# EAGLE design Meanwell_FE (EAGLE 9.7.0)

## Sheet 1 of 2
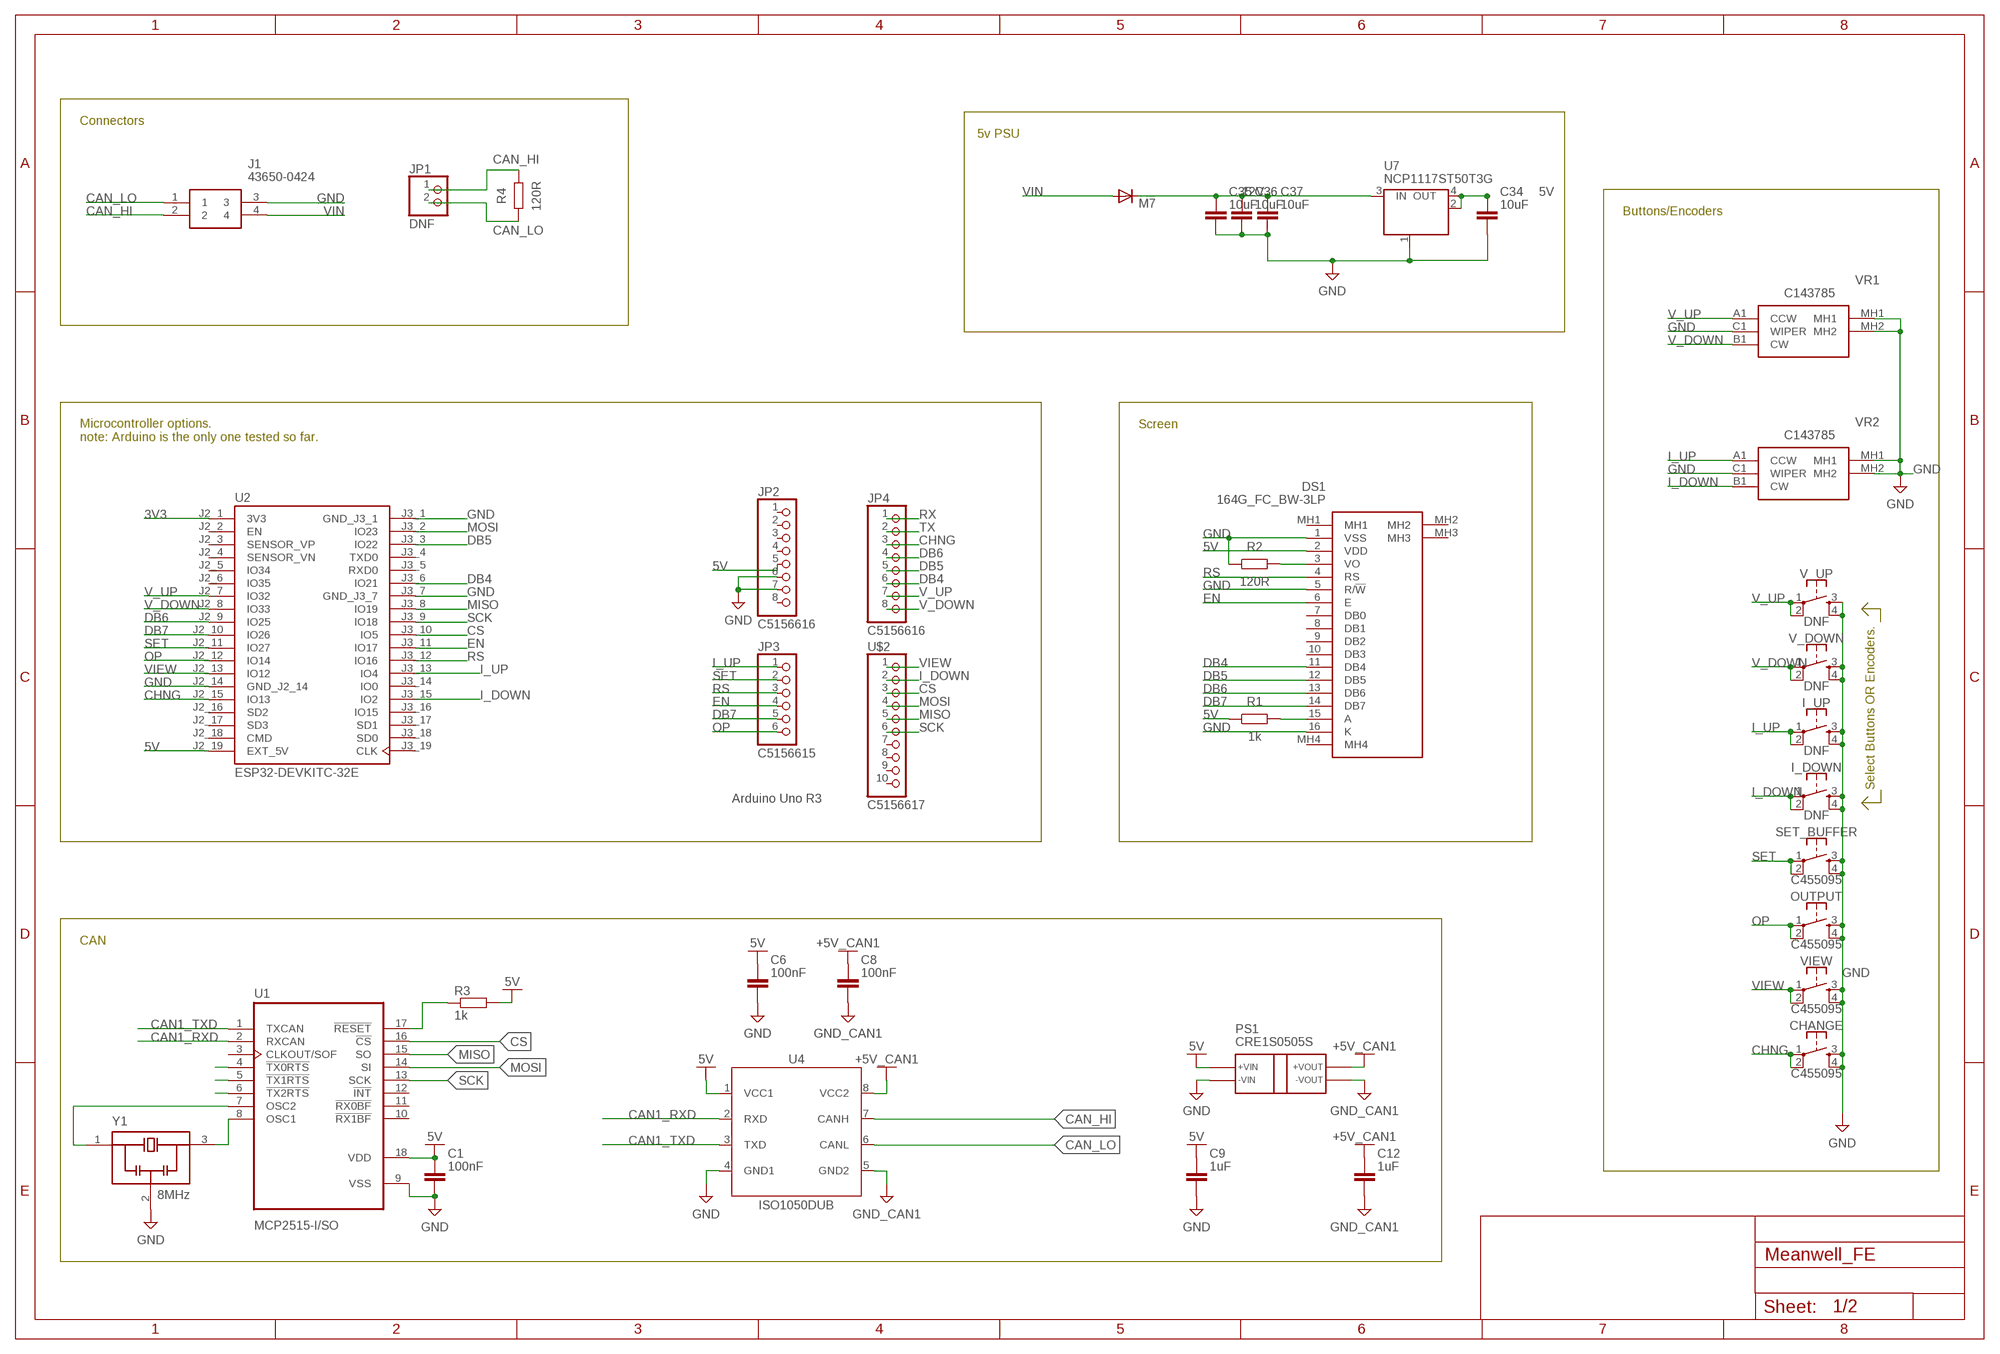
[diagram p0: schematic, sheet 1]

### Parts
C1  100nF  C_CHIP-0603(1608-METRIC)  [CAPC1608X85]
C6  100nF  C_CHIP-0603(1608-METRIC)  [CAPC1608X85]
C8  100nF  C_CHIP-0603(1608-METRIC)  [CAPC1608X85]
C9  1uF  C_CHIP-0603(1608-METRIC)  [CAPC1608X85]
C12  1uF  C_CHIP-0603(1608-METRIC)  [CAPC1608X85]
C34  10uF  C_CHIP-0805(2012-METRIC)  [CAPC2012X110]
C35  10uF  C_CHIP-0805(2012-METRIC)  [CAPC2012X110]
C36  10uF  C_CHIP-0805(2012-METRIC)  [CAPC2012X110]
C37  10uF  C_CHIP-0805(2012-METRIC)  [CAPC2012X110]
CHANGE  C455095  SWITCH_MOMENTARY  [SWITCH-MOMENTARY-PTH-6.5MM]
D1  M7  DIODE-SMB  [SMB]
DS1  164G_FC_BW-3LP  [164GFCBW3LP]
I_DOWN  DNF  SWITCH_MOMENTARY  [SWITCH-MOMENTARY-PTH-6.5MM]
I_UP  DNF  SWITCH_MOMENTARY  [SWITCH-MOMENTARY-PTH-6.5MM]
J1  43650-0424  [43650-04YY_242526]
JP1  DNF  PINHD-1X2  [1X02]
JP2  C5156616  PINHD-1X8BIG  [1X08-BIG]
JP3  C5156615  PINHD-1X6B  [1X06-BIG]
JP4  C5156616  PINHD-1X8BIG  [1X08-BIG]
OUTPUT  C455095  SWITCH_MOMENTARY  [SWITCH-MOMENTARY-PTH-6.5MM]
PS1  CRE1S0505S  [CRE1(SC)]
R1  1k  R_CHIP-0603(1608-METRIC)  [RESC1608X60]
R2  120R  R_CHIP-0603(1608-METRIC)  [RESC1608X60]
R3  1k  R_CHIP-0603(1608-METRIC)  [RESC1608X60]
R4  120R  R_CHIP-0603(1608-METRIC)  [RESC1608X60]
SET_BUFFER  C455095  SWITCH_MOMENTARY  [SWITCH-MOMENTARY-PTH-6.5MM]
U1  MCP2515-I/SO  [SOIC127P1030X265-18N]
U2  ESP32-DEVKITC-32E  [MODULE_ESP32-DEVKITC-32E]
U4  ISO1050DUB  [SOP254P1040X485-8]
U7  NCP1117ST50T3G  MC33269ST-3.3T3  [SOT223]
U$2  C5156617  PINHD-1X10  [1X10-BIG]
V_DOWN  DNF  SWITCH_MOMENTARY  [SWITCH-MOMENTARY-PTH-6.5MM]
V_UP  DNF  SWITCH_MOMENTARY  [SWITCH-MOMENTARY-PTH-6.5MM]
VIEW  C455095  SWITCH_MOMENTARY  [SWITCH-MOMENTARY-PTH-6.5MM]
VR1  C143785  PEC12R-4215F-N0024  [PEC12R4215FN0024]
VR2  C143785  PEC12R-4215F-N0024  [PEC12R4215FN0024]
Y1  8MHz  CSTNE8M00GH5C000R0  [OSC_CSTNE8M00GH5C000R0]

### Nets
3V3: U2.J2_1(3V3)
5V: C1.1 C6.1 C9.1 C34.1 DS1.2(VDD) JP2.5 PS1.2(+VIN) R1.1 R3.2 U1.18(VDD) U2.J2_19(EXT_5V) U4.1(VCC1) U7.2(OUT) U7.4(OUT)
12V: C35.1 C36.1 C37.1 D1.C U7.3(IN)
+5V_CAN1: C8.1 C12.1 PS1.4(+VOUT) U4.8(VCC2)
CAN1_RXD: U1.2(RXCAN) U4.2(RXD)
CAN1_TXD: U1.1(TXCAN) U4.3(TXD)
CAN_HI: J1.2 JP1.1 R4.2 U4.7(CANH)
CAN_LO: J1.1 JP1.2 R4.1 U4.6(CANL)
CHNG: CHANGE.1 CHANGE.2 JP4.3 U2.J2_15(IO13)
CS: U1.16(!CS) U2.J3_10(IO5) U$2.3
DB4: DS1.11(DB4) JP4.6 U2.J3_6(IO21)
DB5: DS1.12(DB5) JP4.5 U2.J3_3(IO22)
DB6: DS1.13(DB6) JP4.4 U2.J2_9(IO25)
DB7: DS1.14(DB7) JP3.5 U2.J2_10(IO26)
EN: DS1.6(E) JP3.4 U2.J3_11(IO17)
GND: C1.2 C6.2 C9.2 C34.2 C35.2 C36.2 C37.2 CHANGE.3 CHANGE.4 DS1.1(VSS) DS1.5(R/!W) DS1.16(K) I_DOWN.3 I_DOWN.4 I_UP.3 I_UP.4 J1.3 JP2.6 JP2.7 OUTPUT.3 OUTPUT.4 PS1.1(-VIN) R2.1 SET_BUFFER.3 SET_BUFFER.4 U1.9(VSS) U2.J2_14(GND_J2_14) U2.J3_1(GND_J3_1) U2.J3_7(GND_J3_7) U4.4(GND1) U7.1(GND/ADJ) V_DOWN.3 V_DOWN.4 V_UP.3 V_UP.4 VIEW.3 VIEW.4 VR1.C1(WIPER) VR1.MH1 VR1.MH2 VR2.C1(WIPER) VR2.MH1 VR2.MH2 Y1.2(GND)
GND_CAN1: C8.2 C12.2 PS1.3(-VOUT) U4.5(GND2)
I_DOWN: I_DOWN.1 I_DOWN.2 U2.J3_15(IO2) U$2.2 VR2.B1(CW)
I_UP: I_UP.1 I_UP.2 JP3.1 U2.J3_13(IO4) VR2.A1(CCW)
MISO: U1.15(SO) U2.J3_8(IO19) U$2.5
MOSI: U1.14(SI) U2.J3_2(IO23) U$2.4
N$1: DS1.3(VO) R2.2
N$6: U1.7(OSC2) Y1.1(IN)
N$8: DS1.15(A) R1.2
N$12: R3.1 U1.17(!RESET)
N$13: U1.8(OSC1) Y1.3(OUT)
N$170: U1.4(!TX0RTS)
N$171: U1.5(!TX1RTS)
N$172: U1.6(!TX2RTS)
OP: JP3.6 OUTPUT.1 OUTPUT.2 U2.J2_12(IO14)
RS: DS1.4(RS) JP3.3 U2.J3_12(IO16)
RX: JP4.1
SCK: U1.13(SCK) U2.J3_9(IO18) U$2.6
SET: JP3.2 SET_BUFFER.1 SET_BUFFER.2 U2.J2_11(IO27)
TX: JP4.2
V_DOWN: JP4.8 U2.J2_8(IO33) V_DOWN.1 V_DOWN.2 VR1.B1(CW)
V_UP: JP4.7 U2.J2_7(IO32) V_UP.1 V_UP.2 VR1.A1(CCW)
VIEW: U2.J2_13(IO12) U$2.1 VIEW.1 VIEW.2
VIN: D1.A J1.4
Unconnected: DS1.7(DB0) DS1.8(DB1) DS1.9(DB2) DS1.10(DB3) DS1.MH1 DS1.MH2 DS1.MH3 DS1.MH4 JP2.1 JP2.2 JP2.3 JP2.4 JP2.8 U1.3(CLKOUT/SOF) U1.10(!RX1BF) U1.11(!RX0BF) U1.12(!INT) U2.J2_2(EN) U2.J2_3(SENSOR_VP) U2.J2_4(SENSOR_VN) U2.J2_5(IO34) U2.J2_6(IO35) U2.J2_16(SD2) U2.J2_17(SD3) U2.J2_18(CMD) U2.J3_4(TXD0) U2.J3_5(RXD0) U2.J3_14(IO0) U2.J3_16(IO15) U2.J3_17(SD1) U2.J3_18(SD0) U2.J3_19(CLK) U$2.7 U$2.8 U$2.9 U$2.10

### Notes on the sheet
- Connectors
- 5v PSU
- Buttons/Encoders
- Screen
- Microcontroller options.
  note: Arduino is the only one tested so far.
- Select Buttons OR Encoders.
- Arduino Uno R3
- CAN

## Sheet 2 of 2
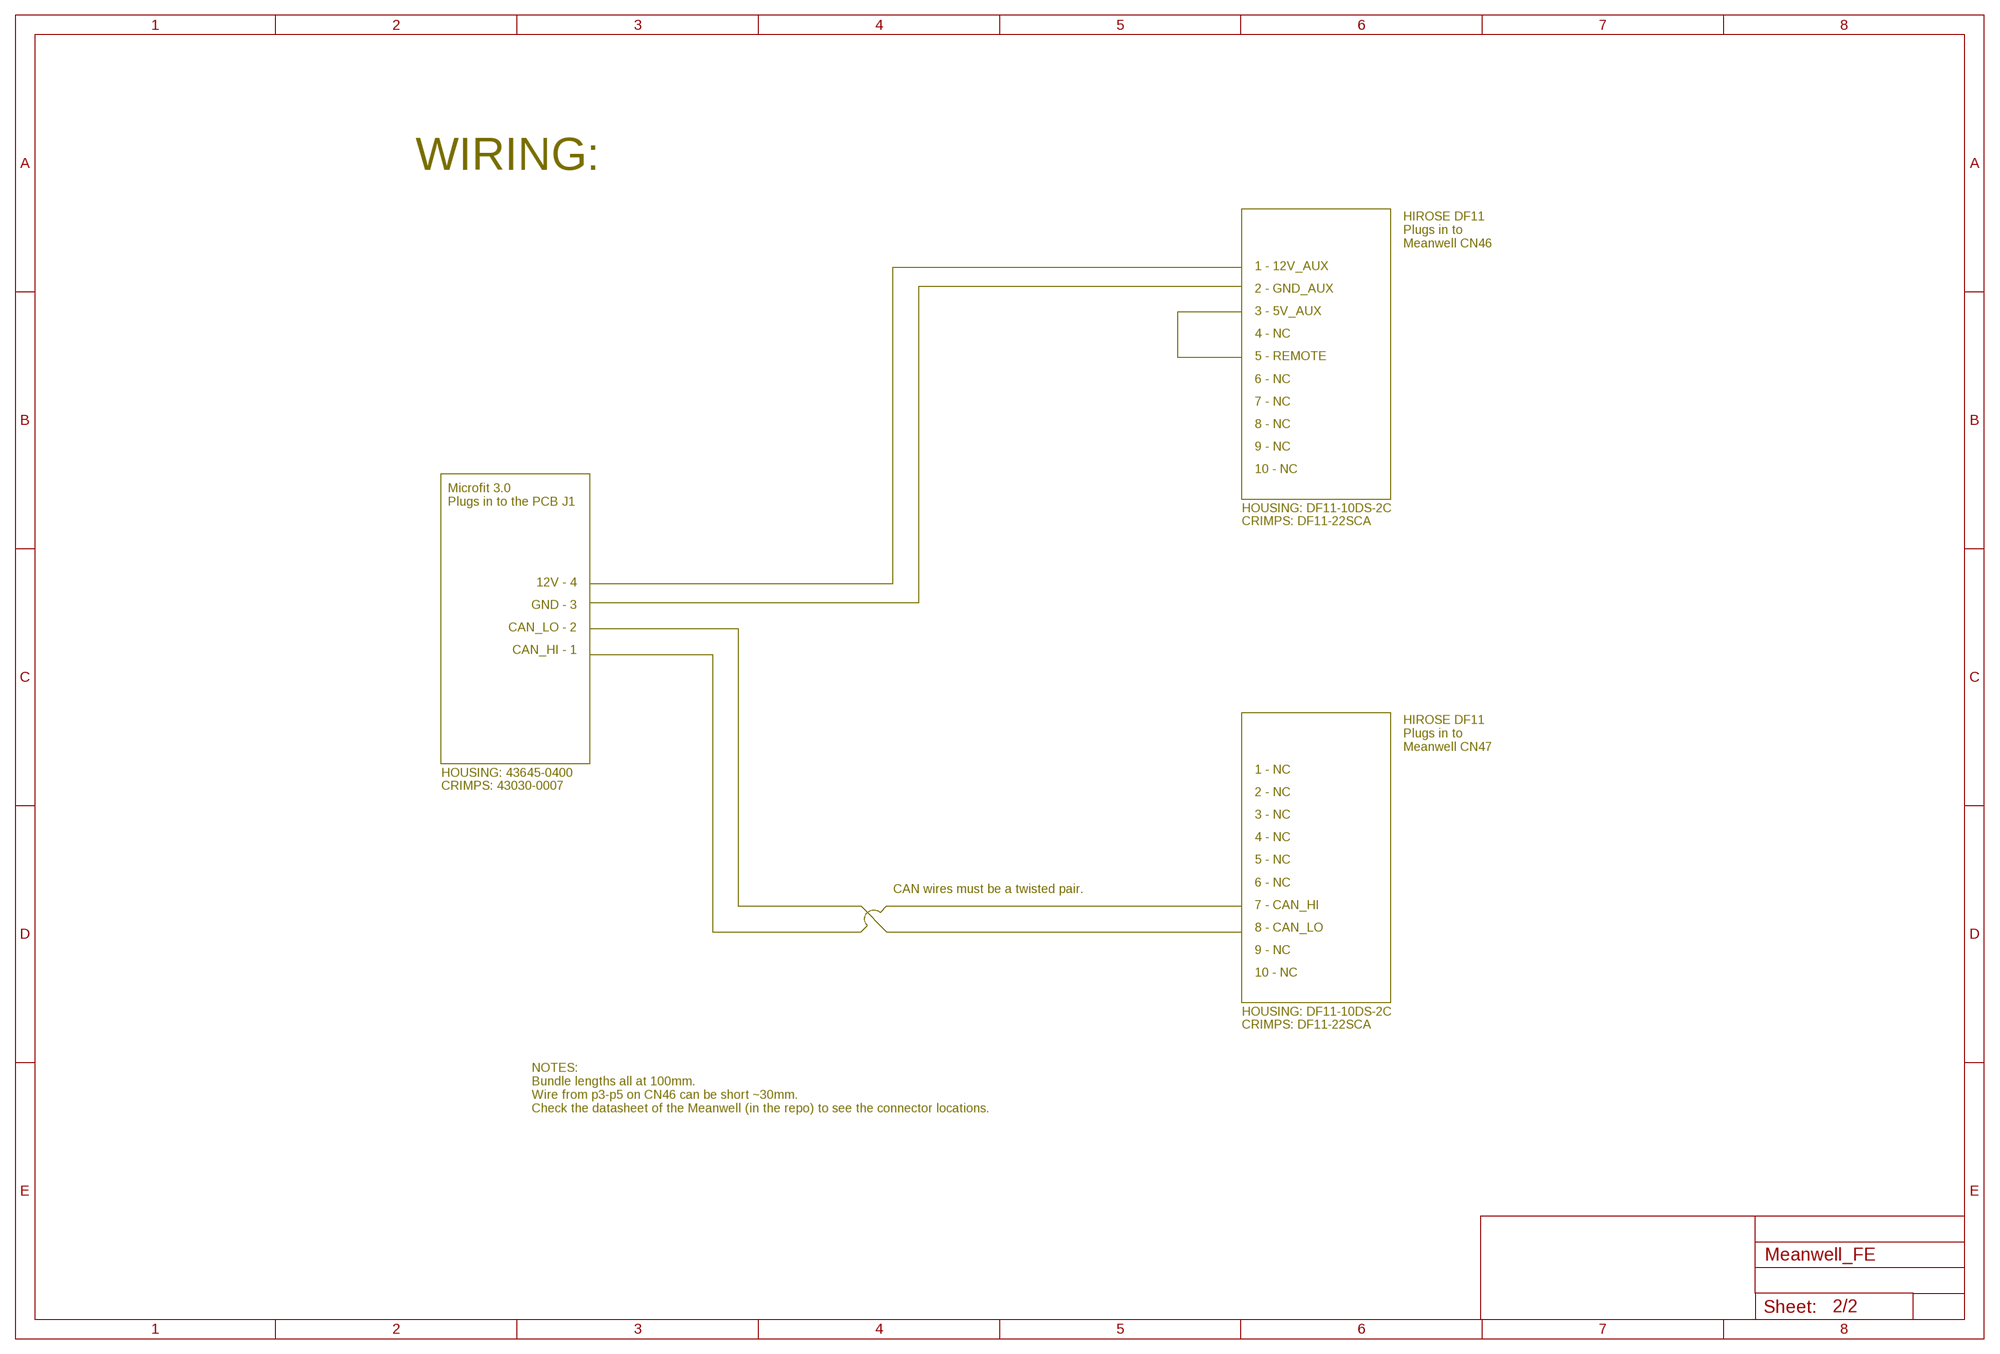
[diagram p1: schematic, sheet 2]

### Notes on the sheet
- WIRING:
- HIROSE DF11
  Plugs in to 
  Meanwell CN46
- 1 - 12V_AUX
  2 - GND_AUX
  3 - 5V_AUX
  4 - NC
  5 - REMOTE
  6 - NC
  7 - NC
  8 - NC
  9 - NC
  10 - NC
- Microfit 3.0
  Plugs in to the PCB J1
- HOUSING: DF11-10DS-2C
- CRIMPS: DF11-22SCA
- 12V - 4
  GND - 3
  CAN_LO - 2
  CAN_HI - 1
- HIROSE DF11
  Plugs in to 
  Meanwell CN47
- HOUSING: 43645-0400
- CRIMPS: 43030-0007
- CAN wires must be a twisted pair.
- 1 - NC
  2 - NC
  3 - NC
  4 - NC
  5 - NC
  6 - NC
  7 - CAN_HI
  8 - CAN_LO
  9 - NC
  10 - NC
- HOUSING: DF11-10DS-2C
- CRIMPS: DF11-22SCA
- NOTES:
  Bundle lengths all at 100mm.
  Wire from p3-p5 on CN46 can be short ~30mm.
  Check the datasheet of the Meanwell (in the repo) to see the connector locations.

## Library data of the parts
C1 C6 C8 C9 C12 = Capacitor:C: Capacitor - Generic; CATEGORY: Capacitor; PACKAGE_SIZE: 0603; PACKAGE_TYPE: SMD; SUBCATEGORY: Ceramic Capacitors; TYPE: MLCC
C34-C37 = Capacitor:C: Capacitor - Generic; CATEGORY: Capacitor; PACKAGE_SIZE: 0805; PACKAGE_TYPE: SMD; SUBCATEGORY: Ceramic Capacitors; TYPE: MLCC
CHANGE I_DOWN I_UP OUTPUT SET_BUFFER V_DOWN V_UP VIEW = Tinkercad:SWITCH_MOMENTARY
D1 = Diode:DIODE-: DIODE
DS1 = Jack'sLib:164G_FC_BW-3LP: LCD Character Display Modules & Accessories 16x4 Char Display FSTN White 6 oclock Source: Datasheet <https://datasheet.datasheetarchive.com/originals/distributors/Datasheets_SAMA/5906eb3b59377bdb5eee9d672233fb3c.pdf>; DESCRIPTION: LCD Character Display Modules & Accessories 16x4 Char Display FSTN White 6 oclock; HEIGHT: 10.6mm; MANUFACTURER_NAME: Displaytech; MANUFACTURER_PART_NUMBER: 164G FC BW-3LP; MOUSER_PART_NUMBER: N/A; MOUSER_PRICE-STOCK: https://www.mouser.co.uk/ProductDetail/Displaytech/164G-FC-BW-3LP?qs=BJlw7L4Cy78q8isRIsBUGg%3D%3D
J1 = Jack'sLib:43650-0424: Micro-Fit 3.0 Vertical Header, 3.00mm Pitch, Single Row, 4 Circuits, with Solder Tab Source: Datasheet <https://www.molex.com/pdm_docs/sd/436500224_sd.pdf>; DESCRIPTION: Micro-Fit 3.0 Vertical Header, 3.00mm Pitch, Single Row, 4 Circuits, with Solder Tab; HEIGHT: 9.9mm; MANUFACTURER_NAME: Molex; MANUFACTURER_PART_NUMBER: 43650-0424; MOUSER_PART_NUMBER: 538-43650-0424; MOUSER_PRICE-STOCK: https://www.mouser.co.uk/ProductDetail/Molex/43650-0424?qs=9hH17QIRXQ1aOH%2Fg6k69OQ%3D%3D
JP1 = Connector:PINHD-1X2: PIN HEADER; CATEGORY: Headers; DESCRIPTION: Header-Straight-2 Position; PACKAGE_TYPE: THT; PITCH: 0.100" (2.54mm); SUBCATEGORY: Headers-Male Pins; TYPE: Board to Board or Cable-Unshrouded-Through Hole-Straight
JP2 JP4 = adafruit:PINHD-1X8: PIN HEADER
JP3 = adafruit:PINHD-1X6: PIN HEADER
PS1 = ISO_DCDCs:CRE1S0505S: Isolated 1W Single Output Isolated DC/DC Converters Source: Datasheet <http://power.murata.com/datasheet?/data/power/ncl/kdc_cre1.pdf>; DESCRIPTION: Isolated 1W Single Output Isolated DC/DC Converters; HEIGHT: mm; MANUFACTURER_NAME: Murata Electronics; MANUFACTURER_PART_NUMBER: CRE1S2405SC; MOUSER_PART_NUMBER: 580-CRE1S2405SC; MOUSER_PRICE-STOCK: https://www.mouser.co.uk/ProductDetail/Murata-Power-Solutions/CRE1S2405SC?qs=pFP7BvE1PmwUsyXD%252BXcXxQ%3D%3D
R1-R4 = Resistor:R: Resistor Fixed - Generic; CATEGORY: Resistors; DESCRIPTION: Chip Resistor 1.60 X 0.82 X 0.60 mm body 0603(1608-METRIC) Package; PACKAGE_SIZE: 0603; PACKAGE_TYPE: SMD
U1 = MCP2515:MCP2515-I/SO: Check availability <https://pricing.snapeda.com/parts/MCP2515-I/SO/Microchip/view-part?ref=eda>; AVAILABILITY: In Stock; CHECK_PRICES: https://www.snapeda.com/parts/MCP2515-I/SO/Microchip/view-part/?ref=eda; DESCRIPTION: Microchip CAN Controller 1Mbit/s CAN 2.0B 18-Pin SOIC W | Microchip Technology Inc. MCP2515-I/SO; MF: Microchip; MP: MCP2515-I/SO; PACKAGE: SOIC-18 Microchip; PRICE: None; SNAPEDA_LINK: https://www.snapeda.com/parts/MCP2515-I/SO/Microchip/view-part/?ref=snap
U2 = Jack'sLib:ESP32-DEVKITC-32E; MANUFACTURER: Espressif Systems; PARTREV: 1.4; STANDARD: Manufacturer Recommendations
U4 = IC_Interface:ISO1050DUB*: Isolated CAN Transceiver SOP-8 Datasheet <https://www.ti.com/lit/ds/symlink/iso1050.pdf?HQS=dis-dk-null-digikeymode-dsf-pf-null-wwe&ts=1611898260031>; CATEGORY: Interface IC; DATASHEET: https://www.ti.com/lit/ds/symlink/iso1050.pdf; DESCRIPTION: 1/1 Transceiver - Isolated Half CANbus 8-SOP; MANUFACTURER: Texas Instruments; MPN: ISO1050DUB; OPERATING_TEMPERATURE: -55°C ~ 105°C; PACKAGE_SIZE: 8-SOP; PACKAGE_TYPE: SMD; PART_STATUS: OBSOLETE; ROHS: COMPLIANT; SERIES: ISO1050; SUBCATEGORY: CANbus Transceiver; TYPE: Isolated Transceiver
U7 = linear:MC33269ST*: Adjustable Output Low Dropout Voltage Regulator 800 mA Source: http://www.onsemi.com/pub/Collateral/MC33269-D.PDF
U$2 = adafruit:PINHD-1X10: Pin header 1x10 0.1" spacing With round pins
VR1 VR2 = Jack'sLib:PEC12R-4215F-N0024: Encoders ENCODER Source: Datasheet <https://www.arrow.com/en/products/pec12r-4215f-n0024/bourns>; DESCRIPTION: Encoders ENCODER; HEIGHT: 15mm; MANUFACTURER_NAME: Bourns; MANUFACTURER_PART_NUMBER: PEC12R-4215F-N0024; MOUSER_PART_NUMBER: 652-PEC12R4215FN0024; MOUSER_PRICE-STOCK: https://www.mouser.co.uk/ProductDetail/Bourns/PEC12R-4215F-N0024?qs=pxDZlBjcsChk7Z90MBi1FA%3D%3D
Y1 = CSTNE8M00GH5C000R0:CSTNE8M00GH5C000R0: Check availability <https://pricing.snapeda.com/parts/CSTNE8M00GH5C000R0/Murata%20Electronics/view-part?ref=eda>; AVAILABILITY: In Stock; CHECK_PRICES: https://www.snapeda.com/parts/CSTNE8M00GH5C000R0/Murata+Electronics+North+America/view-part/?ref=eda; DESCRIPTION: 8 MHz Ceramic Resonator Built in Capacitor 33 pF ±0.13% 40 Ohms -40°C ~ 125°C Surface Mount; MF: Murata Electronics; MP: CSTNE8M00GH5C000R0; PACKAGE: SMD-3 Murata; PRICE: None; SNAPEDA_LINK: https://www.snapeda.com/parts/CSTNE8M00GH5C000R0/Murata+Electronics+North+America/view-part/?ref=snap

## Board
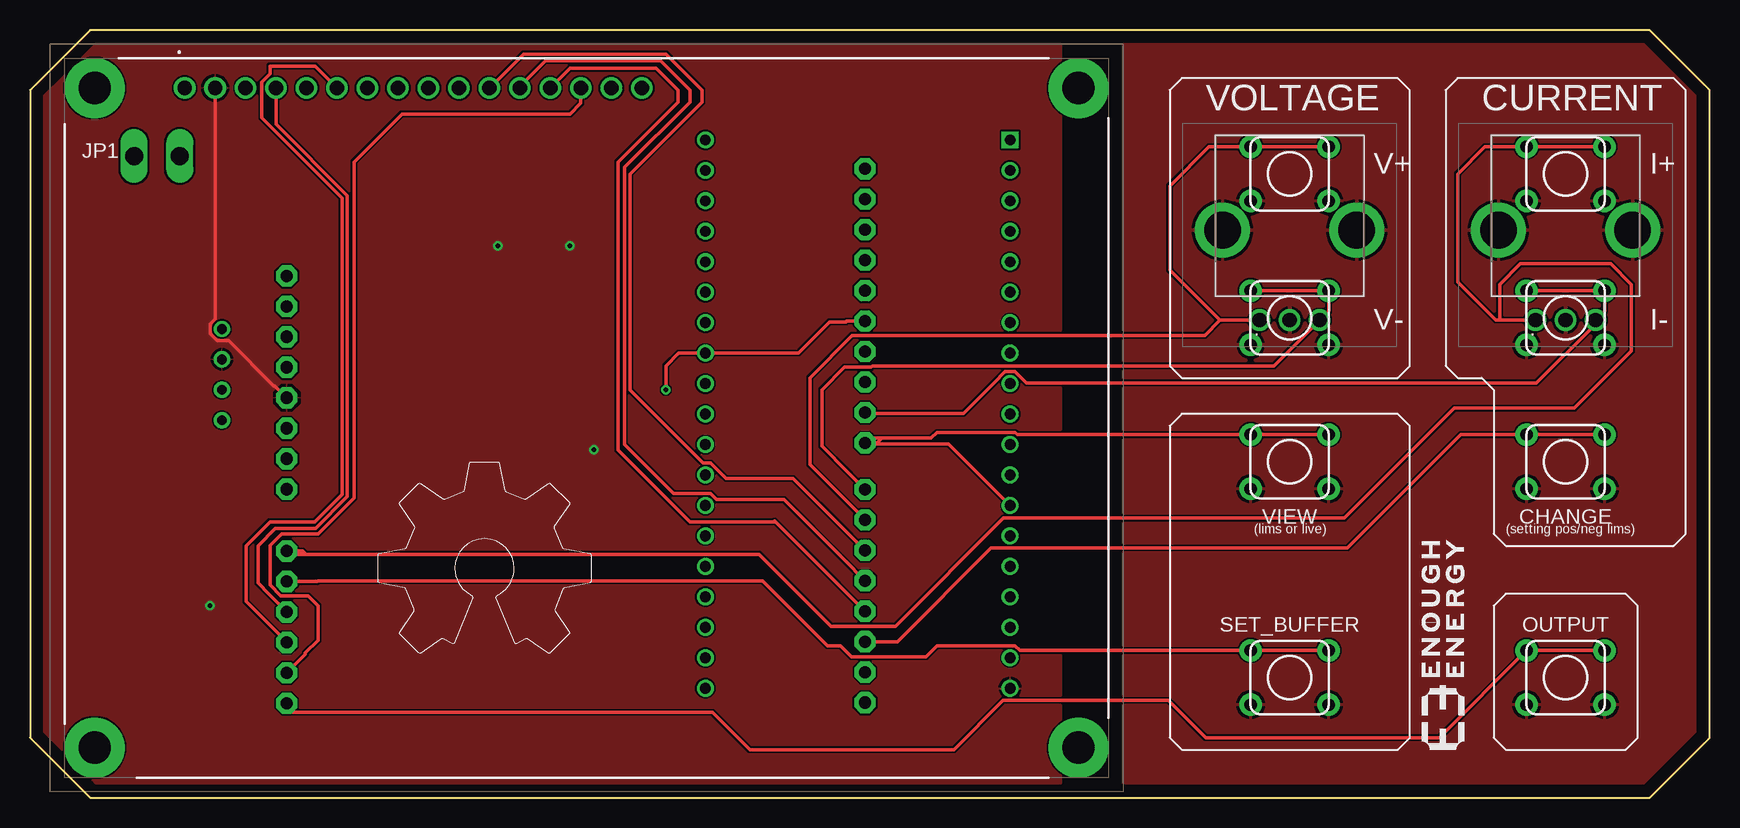
[diagram p2: board, top side]
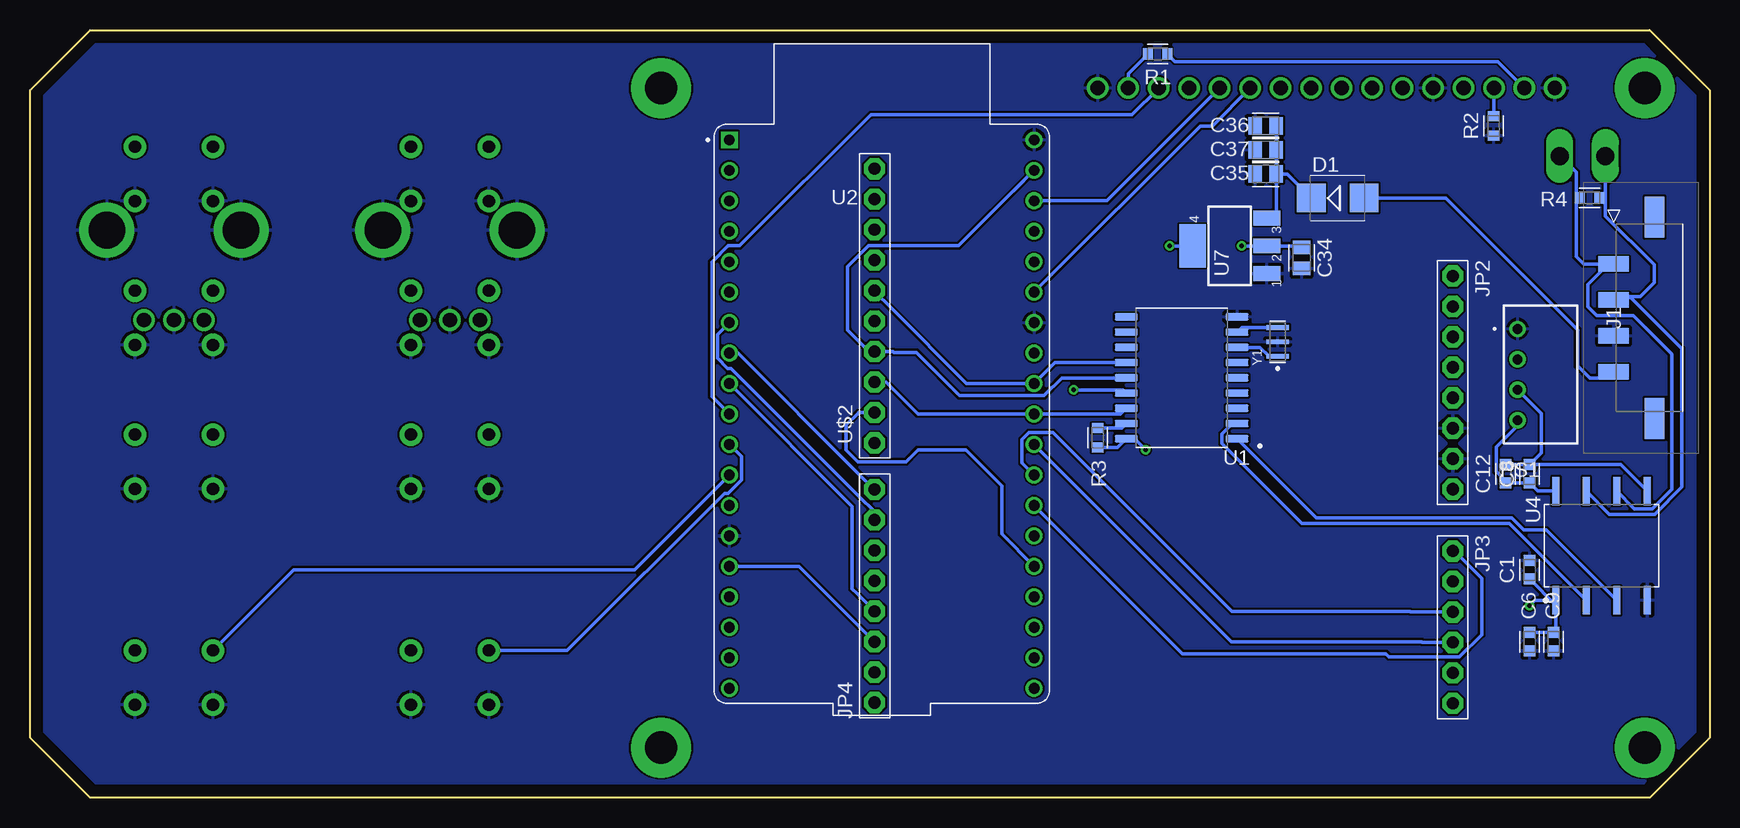
[diagram p3: board, bottom side, seen from below]

Size 140 x 64 mm. Coordinates in mm from the lower left corner, seen from the top.
Outline: 135,64 5,64 0,59 0,5 5,0 135,0 140,5 140,59 135,64
Copper layers (1*16): Top / Bottom
Stack-up Default Layer Stack: Top SilkScreen Epoxy Ink / Top SolderMask SR:Green 0.0254mm Dk 4.3 / Top Surface Finish Lead-Free 0.02mm / Top CuFoil:007 0.035mm / Dielectric-1 User Defined 1.5mm / Bottom CuFoil:007 0.035mm / Bottom Surface Finish Lead-Free 0.02mm / Bottom SolderMask SR:Green 0.0254mm Dk 4.3 / Bottom SilkScreen Epoxy Ink
Design rules: minimum copper width 0.3mm, minimum drill size 0.35mm, copper clearance wire_polygon to wire_polygon 6mil, copper clearance wire_polygon to pad_smd 6mil, copper clearance wire_polygon to via 6mil, copper clearance pad_smd to pad_smd 6mil, copper clearance pad_smd to via 6mil, copper clearance via to via 0.3mm, copper clearance smd to pad (same net) 0.3mm, copper clearance smd to via (same net) 0.3mm, copper clearance smd to smd (same net) 0.3mm, dimension clearance 40mil, via restrict clearance 0mil, restrict clearance 0mil, drill distance 0.3mm, keepout clearance 0mil

### Footprints (pad centres in the part's own frame; a part is rotated, then mirrored left to right if it is on the bottom)
CAPC1608X85 = smd 0.921 x 0.97: 1 -0.775,0; 2 0.775,0
CAPC2012X110 = smd 1.165 x 1.465: 1 -0.875,0; 2 0.875,0
SWITCH-MOMENTARY-PTH-6.5MM = drill 1.016 pad 1.88: 1 -3.251,2.261; 2 3.251,2.261; 3 -3.251,-2.261; 4 3.251,-2.261
SMB = smd 2.4 x 2.4: A 2.2,0; C -2.2,0
164GFCBW3LP = drill 1.2 pad 1.8: 1 0,0; 2 2.54,0; 3 5.08,0; 4 7.62,0; 5 10.16,0; 6 12.7,0; 7 15.24,0; 8 17.78,0; 9 20.32,0; 10 22.86,0; 11 25.4,0; 12 27.94,0; 13 30.48,0; 14 33.02,0; 15 35.56,0; 16 38.1,0 | drill 2.7 pad 5: MH1 -7.5,0; MH2 -7.5,-55; MH3 74.5,-55; MH4 74.5,0
43650-04YY_242526 = smd 1.27 x 2.54: 1 4.5,0; 2 1.5,0; 3 -1.5,0; 4 -4.5,0 | smd 3.43 x 1.65: 5 8.385,-3.42; 6 -8.385,-3.42
1X02 = drill 1.499 long: 1 -1.27,0; 2 2.54,0
1X08-BIG = drill 1.016 pad 1.778 octagon: 1 -8.89,0; 2 -6.35,0; 3 -3.81,0; 4 -1.27,0; 5 1.27,0; 6 3.81,0; 7 6.35,0; 8 8.89,0
1X06-BIG = drill 1.016 pad 1.778 octagon: 1 -6.35,0; 2 -3.81,0; 3 -1.27,0; 4 1.27,0; 5 3.81,0; 6 6.35,0
CRE1(SC) = drill 0.83 pad 1.33: 1 -5.08,0; 2 -2.54,0; 3 0,0; 4 2.54,0
RESC1608X60 = smd 0.799 x 0.974: 1 -0.815,0; 2 0.815,0
SOIC127P1030X265-18N = smd 1.91 x 0.6: 1 -4.61,5.08; 2 -4.61,3.81; 3 -4.61,2.54; 4 -4.61,1.27; 5 -4.61,0; 6 -4.61,-1.27; 7 -4.61,-2.54; 8 -4.61,-3.81; 9 -4.61,-5.08; 10 4.61,-5.08; 11 4.61,-3.81; 12 4.61,-2.54; 13 4.61,-1.27; 14 4.61,0; 15 4.61,1.27; 16 4.61,2.54; 17 4.61,3.81; 18 4.61,5.08
MODULE_ESP32-DEVKITC-32E = drill 0.9 square: J2_1 -12.7,22.835 | drill 0.9: J2_2 -12.7,20.295; J2_3 -12.7,17.755; J2_4 -12.7,15.215; J2_5 -12.7,12.675; J2_6 -12.7,10.135; J2_7 -12.7,7.595; J2_8 -12.7,5.055; J2_9 -12.7,2.515; J2_10 -12.7,-0.025; J2_11 -12.7,-2.565; J2_12 -12.7,-5.105; J2_13 -12.7,-7.645; J2_14 -12.7,-10.185; J2_15 -12.7,-12.725; J2_16 -12.7,-15.265; J2_17 -12.7,-17.805; J2_18 -12.7,-20.345; J2_19 -12.7,-22.885; J3_1 12.7,22.835; J3_2 12.7,20.295; J3_3 12.7,17.755; J3_4 12.7,15.215; J3_5 12.7,12.675; J3_6 12.7,10.135; J3_7 12.7,7.595; J3_8 12.7,5.055; J3_9 12.7,2.515; J3_10 12.7,-0.025; J3_11 12.7,-2.565; J3_12 12.7,-5.105; J3_13 12.7,-7.645; J3_14 12.7,-10.185; J3_15 12.7,-12.725; J3_16 12.7,-15.265; J3_17 12.7,-17.805; J3_18 12.7,-20.345; J3_19 12.7,-22.885
SOP254P1040X485-8 = smd 2.35 x 0.65: 1 -4.55,3.81; 2 -4.55,1.27; 3 -4.55,-1.27; 4 -4.55,-3.81; 5 4.55,-3.81; 6 4.55,-1.27; 7 4.55,1.27; 8 4.55,3.81
SOT223 = smd 1.219 x 2.235: 1 -2.311,-3.099; 2 0,-3.099; 3 2.311,-3.099 | smd 3.6 x 2.2: 4 0,3.099
1X10-BIG = drill 1.016 pad 1.778 octagon: 1 -11.43,0; 2 -8.89,0; 3 -6.35,0; 4 -3.81,0; 5 -1.27,0; 6 1.27,0; 7 3.81,0; 8 6.35,0; 9 8.89,0; 10 11.43,0
PEC12R4215FN0024 = drill 1.2 pad 1.8: A1 0,0; B1 5,0; C1 2.5,0 | drill 3.05 pad 4.575: MH1 -3.1,7.5; MH2 8.1,7.5
OSC_CSTNE8M00GH5C000R0 = smd 0.4 x 1.9: 1 -1.2,0; 2 0,0; 3 1.2,0

### Placement (x,y rotation side)
C1  15,19 90 bottom
C6  15,13 270 bottom
C8  15,27 90 bottom
C9  13,13 270 bottom
C12  17,27 90 bottom
C34  34,45 270 bottom
C35  37,52 180 bottom
C36  37,56 180 bottom
C37  37,54 180 bottom
CHANGE  128,28 0 top
D1  31,50 0 bottom
DS1  12.89,59.16 0 top
I_DOWN  128,40 0 top
I_UP  128,52 0 top
J1  8,40 90 bottom
JP1  9.94,53.49 0 top
JP2  21.4,34.6 270 bottom
JP3  21.4,14.2 270 bottom
JP4  69.6,16.8 90 bottom
OUTPUT  128,10 0 top
PS1  16,34 270 bottom
R1  46,62 180 bottom
R2  18,56 90 bottom
R3  51,30 270 bottom
R4  10,50 0 bottom
SET_BUFFER  105,10 0 top
U1  44,35 180 bottom
U2  69,32 0 bottom
U4  9,21 90 bottom
U7  40,46 90 bottom
U$2  69.6,41 90 bottom
V_DOWN  105,40 0 top
V_UP  105,52 0 top
VIEW  105,28 0 top
VR1  102.5,39.81 0 top
VR2  125.5,39.81 0 top
Y1  36,38 90 bottom

### Tracks (layer width: path | path; a pad name or v marks a point on that pad's centre or on a via)
5V  (via drill 0.35)
  Top 0.3: DS1.2 15.44,39.89 15.03,39.48 15.03,38.68 15.6,38.11 16.55,38.11 20.33,34.33 20.4,34.33 JP2.5
  Bottom 0.3: R1.1 44.55,61.36 17.64,61.36 DS1.2 | U7.4 v45,46 | C34.1 34.12,46 U7.2 v39,46 | R3.2 49.34,29.18 U1.18 47.92,29.92 v47,29 | C6.1 C9.1 12.81,13.96 12.81,16.04 | 12.81,16.04 U4.1 14.55,16.45 v15,16 | C1.1 12.81,16.04
  pour Top: 86,-4 86,68 1,68 -4,63 -4,-4
12V
  Bottom 0.3: D1.C 35.2,52 C35.1 | U7.3 36.39,48.31 36.12,48.58 C35.1 | C36.1 C37.1 C35.1
+5V_CAN1
  Bottom 0.3: C8.1 15.03,26.23 | PS1.4 15.79,31.25 17.79,29.25 17.79,27.19 16.82,26.23 C8.1 | C12.1 C8.1 | C8.1 14.97,26.23 14.3,25.55 U4.8
CAN1_RXD
  Bottom 0.3: U1.2 39.76,31.19 40.65,30.3 40.65,29.54 33.96,22.85 16.67,22.85 U4.2
CAN1_TXD
  Bottom 0.3: U4.3 13.59,22.3 15.48,22.3 16.48,23.3 32.77,23.3 U1.1
CAN_HI
  Bottom 0.3: 8.67,49 8.67,48.5 4.62,44.45 4.62,42.93 5.78,41.78 6.78,41.78 | 8.67,49 JP1.1 | 6.87,41.69 6.78,41.78 | U4.7 8.34,23.62 4.57,23.62 2.31,25.88 2.31,37.44 6.56,41.69 7,41.69 | J1.2 7.81,41.69 7,41.69 | 6.78,41.78 6.91,41.78 7,41.69 | R4.2 8.67,49.48 8.67,49
CAN_LO
  Bottom 0.3: JP1.2 11.12,52.13 11.12,49 | U4.6 6.25,24.07 4.76,24.07 3.16,25.67 3.16,36.99 6.37,40.19 9.41,40.19 10.15,40.93 10.15,42.76 9.21,43.69 8.4,44.5 J1.1 10.5,44.5 11,45 11.12,45.12 11.12,47.43 11.12,49 | R4.1 11.12,49.69 11.12,49
CHNG
  Top 0.3: CHANGE.2 CHANGE.1 119.26,30.26 109.81,20.81 80.12,20.81 72.3,12.99 72,12.99 JP4.3
  Bottom 0.3: U2.J2_15 75.89,19.27 70.81,14.19 70.31,13.69 | 70.31,13.69 69.81,13.19 | 70.31,13.69 JP4.3
CS
  Bottom 0.3: U1.16 49.09,31.98 U2.J3_10 56.37,32.04 56.41,32 66,32 68,34 | 68.58,34.58 68,34 | 68,34 68.65,34.65 U$2.3
DB4
  Top 0.3: DS1.11 41.13,62 53,62 56,59 56,58 50,52 50,34 56.1,27.9 56.72,27.9 58.01,26.61 63.61,26.61 68.11,22.11 JP4.6
  Bottom 0.3: U2.J3_6 42.44,56 41.45,56 DS1.11
DB5
  Top 0.3: DS1.12 40.84,59.32 42.97,61.45 52.55,61.45 55,59 55,58 49.55,52.55 49.55,29.45 53.64,25.36 56.72,25.36 57.24,24.84 62.84,24.84 67.84,19.84 JP4.5
  Bottom 0.3: U2.J3_3 50.24,49.76 DS1.12
DB6
  Top 0.3: DS1.13 45.02,60.8 52.2,60.8 54,59 54,58 49,53 49,29 55,23 62,23 62.07,23.07 66.07,19.07 JP4.4
  Bottom 0.3: U2.J2_9 71.47,24.29 71.47,17.39 71.04,16.96 70.04,15.96 JP4.4
DB7
  Top 0.3: DS1.14 45.91,57.91 45,57 31,57 27,53 27,25 24,22 20.98,22 20,21.02 20,17.73 20.91,16.82 23.18,16.82 24,16 24,13.1 22.95,12.05 22.95,11.94 JP3.5
  Bottom 0.3: U2.J2_10 83.16,33.43 83.16,44.64 81.8,46 80.85,46 69.92,56.94 48.14,56.94 DS1.14
EN
  Top 0.3: DS1.6 23.75,61 20,61 20,60.35 19.31,59.66 19.31,56.69 26,50 26,25.28 23.72,23 20,23 18,21 18,16.34 20.17,14.17 JP3.4
  Bottom 0.3: U2.J3_11 39.85,12.99 24,12.99 23.94,12.93 JP3.4
GND
  pour Top: 91,-4 140,-4 144,0 144,63 139,68 91,68
  pour Bottom: -6,-5 139,-5 144,0 144,63 139,68 1,68 -4,63 -4,-5
GND_CAN1
  Bottom 0.3: C8.2 7.42,27.77 U4.5 | PS1.3 14.03,32.03 14.03,28.72 14.97,27.77 C8.2 | 17.02,27.77 C12.2 C8.2
I_DOWN
  Top 0.3: I_DOWN.1 I_DOWN.2 131.25,40.56 VR2.B1 130.5,39.5 125.58,34.58 83.06,34.58 82.12,35.52 81.28,35.52 80.34,34.58 77.8,32.04 72,32.04 69.67,32.04 U$2.2
  Bottom 0.3: U2.J3_15 59,21.98 59,26 62,29 66,29 67,28 71,28 72,29 72,31 72.01,31.01 70.99,32.04 70.92,32.11 U$2.2
I_UP
  Top 0.3: I_UP.2 I_UP.1 121.26,54.26 119,52 119,43 122.19,39.81 VR2.A1 122.51,39.81 122.51,42.77 124.23,44.5 131.77,44.5 133.49,42.77 133.49,37.23 128.73,32.46 118.71,32.46 109.55,23.29 81.14,23.29 72.14,14.29 66.78,14.29 60.79,20.28 23,20.28 | 21.68,20.28 23,20.28 | 23,20.28 22.73,20.55 JP3.1
  Bottom 0.3: 125.31,40 VR2.A1 | U2.J3_13 45.47,13.53 43.95,12 27,12 26.74,11.74 20.84,11.74 19,13.58 19,18.26 19.87,19.13 21.29,20.55 JP3.1
MISO  (via drill 0.35)
  Top 0.3: v53,34 53,36 54.05,37.05 U2.J3_8 64.06,37.05 66.66,39.66 68,39.66 68.07,39.73 U$2.5
  Bottom 0.3: U1.15 48.88,34 v53,34
MOSI
  Bottom 0.3: 48.24,35 U1.14 54,35 55.49,33.51 62.51,33.51 66.12,37.12 68,37.12 68.07,37.19 U$2.4 70.04,37.19 71.85,39 71.85,44.26 70.11,46 62.59,46 U2.J3_2 58,50.59
N$1
  Bottom 0.3: R2.2 18,59.13 DS1.3
N$6
  Bottom 0.3: U1.7 37.49,37.54 36.75,36.8 Y1.1
N$8
  Bottom 0.3: DS1.15 48.45,60.36 R1.2
N$12
  Bottom 0.3: R3.1 48.98,30.82 U1.17
N$13
  Bottom 0.3: U1.8 39,39.2 Y1.3
OP
  Top 0.3: OUTPUT.2 OUTPUT.1 117.49,5 98,5 94.89,8.11 81.11,8.11 77,4 60,4 56.89,7.11 21.88,7.11 21.4,7.59 JP3.6
  Bottom 0.3: U2.J2_12 89.59,19 118.01,19 OUTPUT.1
RS
  Top 0.3: JP3.3 19.94,16.94 19,17.88 19,21 20.45,22.45 23.81,22.45 26.45,25.09 26.45,50.19 20.52,56.12 DS1.4
  Bottom 0.3: U2.J3_12 57.31,27.9 57.31,29.85 56.72,30.44 54.72,30.44 39.81,15.53 25,15.53 24.94,15.47 JP3.3
SCK
  Bottom 0.3: U1.13 54.55,36.27 U2.J3_9 61.92,34.52 68.2,40.8 69.6,42.19 U$2.6
SET
  Top 0.3: SET_BUFFER.2 SET_BUFFER.1 82.52,12.26 82.12,12.66 75.61,12.66 74.7,11.75 68.46,11.75 67.55,12.66 66.49,12.66 61.08,18.07 24,18.07 23.94,18.01 JP3.2
  Bottom 0.3: U2.J2_11 80.69,28.43 80.69,26.48 81.81,25.36 82.12,25.36 95.22,12.26 SET_BUFFER.1
V_DOWN
  Top 0.3: 108.25,42 108.25,40.56 107.85,40.15 VR1.B1 103.69,36 70.25,36 70.12,35.88 67.88,35.88 66,34 66,29.3 68.15,27.15 JP4.8 | 108.25,42 V_DOWN.2 | V_DOWN.1 107.99,42.26 108.25,42
  Bottom 0.3: U2.J2_8 80.97,37.05 70.96,27.04 JP4.8
V_UP
  Top 0.3: VR1.A1 99.19,39.81 | 99.19,39.81 95,44 95,51 98.26,54.26 V_UP.1 V_UP.2 | JP4.7 68.88,23.88 65,27.76 65,35 68.54,38.54 97.92,38.54 99.19,39.81
  Bottom 0.3: U2.J2_7 82.71,38.59 82.71,36.64 81.85,35.78 81.55,35.78 70.88,25.12 69.61,23.85 69.6,23.84 JP4.7
VIEW
  Top 0.3: VIEW.2 VIEW.1 82.3,30.26 82.12,30.44 75.59,30.44 75.12,29.97 71,29.97 | 71,29.97 70.08,29.97 71,29.97 | U2.J2_13 81.03,25.03 76.56,29.5 72,29.5 69.67,29.5 U$2.1 70.6,29.57 71,29.97
VIN
  Bottom 0.3: 7.7,35 9,35 | 9,35 10,35 11,36 11,39 22,50 D1.A | J1.4 8.5,35 9,35

### Text on the board
NamesTop: VOLTAGE | CURRENT | V+ | I+ | V- | I- | (lims or live) | (setting pos/neg lims)